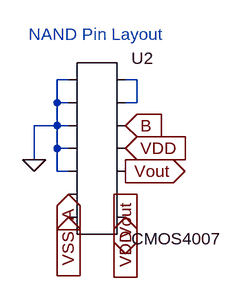
[diagram p0: schematic NAND.asc]
NAND.asc, the LTspice schematic file:
Version 4
SHEET 1 948 680
WIRE 528 64 512 64
WIRE 624 64 608 64
WIRE 512 96 512 64
WIRE 528 96 512 96
WIRE 624 96 624 64
WIRE 624 96 608 96
WIRE 512 128 512 96
WIRE 512 128 480 128
WIRE 528 128 512 128
WIRE 512 160 512 128
WIRE 528 160 512 160
WIRE 480 176 480 128
WIRE 512 192 512 160
WIRE 528 192 512 192
FLAG 608 256 VDD
IOPIN 608 256 In
FLAG 528 224 A
IOPIN 528 224 In
FLAG 608 128 B
IOPIN 608 128 In
FLAG 608 160 VDD
IOPIN 608 160 In
FLAG 608 192 Vout
IOPIN 608 192 Out
FLAG 528 256 VSS
IOPIN 528 256 In
FLAG 480 176 0
FLAG 608 224 Vout
IOPIN 608 224 Out
SYMBOL AutoGenerated\\CMOS4007 560 160 R0
SYMATTR InstName U2
TEXT 472 0 Left 2 ;NAND Pin Layout

The netlist it stands for:
* NAND.asc
* U2: CMOS4007 (symbol AutoGenerated\CMOS4007 not available, pins judged from their places): pin1=0 pin2=0 pin3=0 pin4=0 pin5=0 pin6=A pin7=VSS pin8=N001 pin9=N001 pin10=B pin11=VDD pin12=Vout pin13=Vout pin14=VDD
* NAND Pin Layout
.backanno
.end